# Altium project lab6.PrjPcb
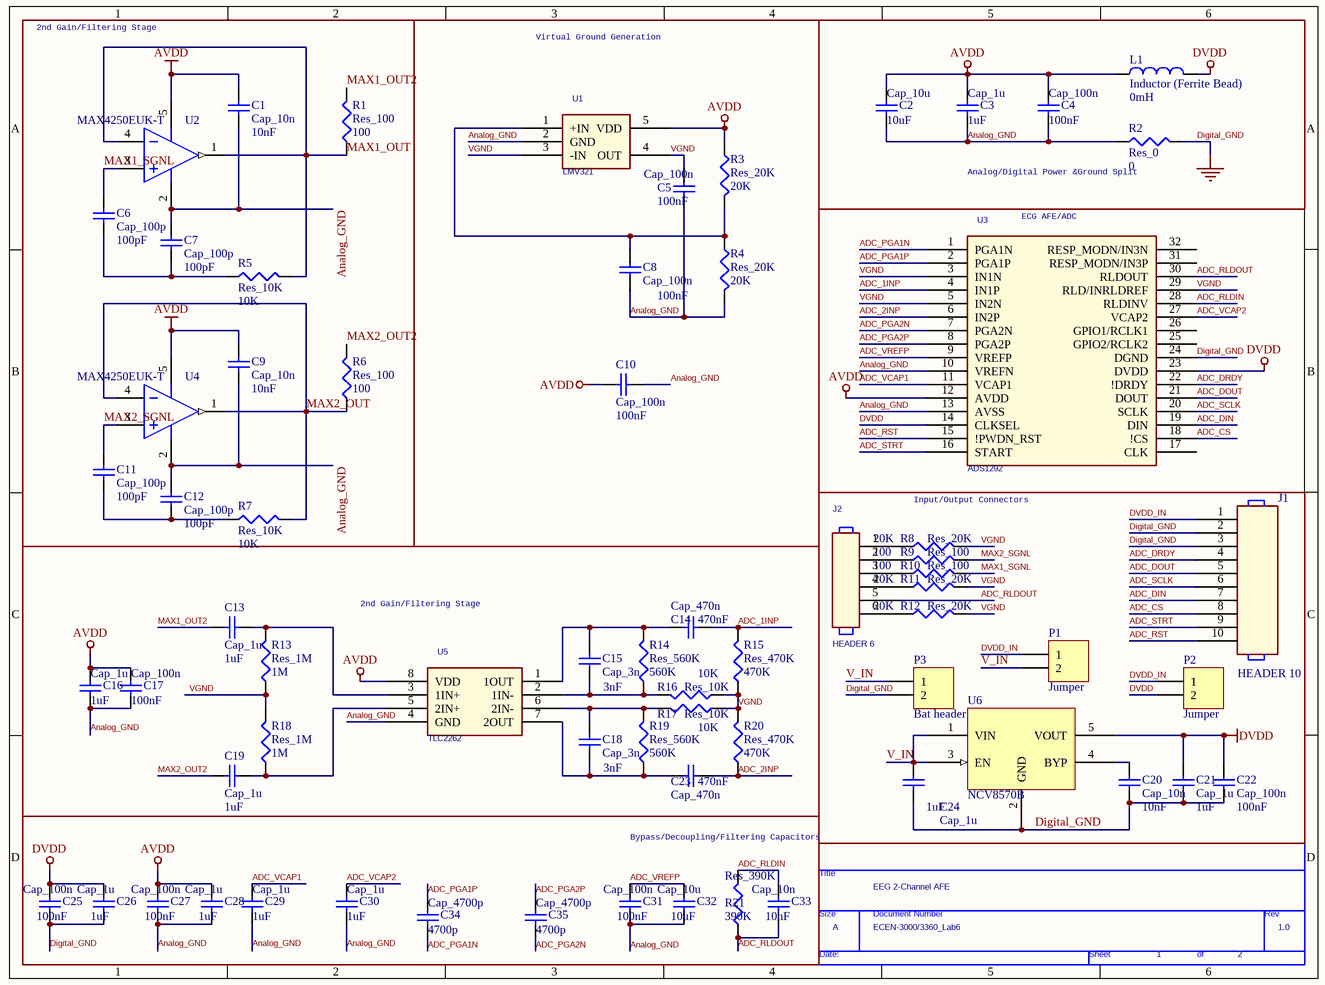
[diagram p0: Lab6.SchDoc]
1 sheet, 69 parts. Net scope: global (net labels, ports and power ports of the same name join across sheets).
Board file: Lab6.PcbDoc

## Sheet Lab6.SchDoc
size 246 x 182 mm

### Parts
*  Page Count: 2  Page Number: 1  Page Size: A  Title: EEG 2-Channel AFE  RevCode: 1.0  Doc: ECEN-3000/3360_Lab6  (hidden comment: TitleBlock0)  (graphical)
C1  Cap_10n  value 10nF  [SMD_0805]
C2  Cap_10u  value 10uF  [SMD_0805]
C3  Cap_1u  value 1uF  [SMD_0805]
C4  Cap_100n  value 100nF  [SMD_0805]
C5  Cap_100n  value 100nF  [SMD_0805]
C6  Cap_100p  value 100pF  [SMD_0805]
C7  Cap_100p  value 100pF  [SMD_0805]
C8  Cap_100n  value 100nF  [SMD_0805]
C9  Cap_10n  value 10nF  [SMD_0805]
C10  Cap_100n  value 100nF  [SMD_0805]
C11  Cap_100p  value 100pF  [SMD_0805]
C12  Cap_100p  value 100pF  [SMD_0805]
C13  Cap_1u  value 1uF  [SMD_0805]
C14  Cap_470n  value 470nF  [SMD_0805]
C15  Cap_3n  value 3nF  [SMD_0805]
C16  Cap_1u  value 1uF  [SMD_0805]
C17  Cap_100n  value 100nF  [SMD_0805]
C18  Cap_3n  value 3nF  [SMD_0805]
C19  Cap_1u  value 1uF  [SMD_0805]
C20  Cap_10n  value 10nF  [SMD_0805]
C21  Cap_1u  value 1uF  [SMD_0805]
C22  Cap_100n  value 100nF  [SMD_0805]
C23  Cap_470n  value 470nF  [SMD_0805]
C24  Cap_1u  value 1uF  [SMD_0805]
C25  Cap_100n  value 100nF  [SMD_0805]
C26  Cap_1u  value 1uF  [SMD_0805]
C27  Cap_100n  value 100nF  [SMD_0805]
C28  Cap_1u  value 1uF  [SMD_0805]
C29  Cap_1u  value 1uF  [SMD_0805]
C30  Cap_1u  value 1uF  [SMD_0805]
C31  Cap_100n  value 100nF  [SMD_0805]
C32  Cap_10u  value 10uF  [SMD_0805]
C33  Cap_10n  value 10nF  [SMD_0805]
C34  Cap_4700p  value 4700p  [SMD_0805]
C35  Cap_4700p  value 4700p  [SMD_0805]
J1  HEADER 10  [HDR1X10]
J2  HEADER 6  [HDR1X6]
L1  Inductor (Ferrite Bead)  value 0mH  [SMD_0805]
P1  Jumper  [HDR1X2]
P2  Jumper  [HDR1X2]
P3  Bat header  [HDR1X2]
R1  Res_100  value 100  [SMD_0805]
R2  Res_0  value 0  [SMD_0805]
R3  Res_20K  value 20K  [SMD_0805]
R4  Res_20K  value 20K  [SMD_0805]
R5  Res_10K  value 10K  [SMD_0805]
R6  Res_100  value 100  [SMD_0805]
R7  Res_10K  value 10K  [SMD_0805]
R8  Res_20K  value 20K  [SMD_0805]
R9  Res_100  value 100  [SMD_0805]
R10  Res_100  value 100  [SMD_0805]
R11  Res_20K  value 20K  [SMD_0805]
R12  Res_20K  value 20K  [SMD_0805]
R13  Res_1M  value 1M  [SMD_0805]
R14  Res_560K  value 560K  [SMD_0805]
R15  Res_470K  value 470K  [SMD_0805]
R16  Res_10K  value 10K  [SMD_0805]
R17  Res_10K  value 10K  [SMD_0805]
R18  Res_1M  value 1M  [SMD_0805]
R19  Res_560K  value 560K  [SMD_0805]
R20  Res_470K  value 470K  [SMD_0805]
R21  Res_390K  value 390K  [SMD_0805]
U1  LMV321  [MAA05A_M]
U2  MAX4250EUK-T  [SOT23-5_L]
U3  ADS1292  [ADS1292_PQFP32]
U4  MAX4250EUK-T  [SOT23-5_L]
U5  TLC2262  [TLC2262_SOIC8]
U6  NCV8570B  [TSOP-5_483-02]

### Blocks framed on the sheet
2nd Gain/Filtering Stage: C1 C6 C7 C9 C11 C12 R1 R5-R7 U2 U4
Virtual Ground Generation: C5 C8 C10 R3 R4 U1
Analog/Digital Power & / Ground Split: C2-C4 L1 R2
Input/Output Connectors: * C20-C22 C24 J1 J2 P1-P3 R8-R12 U6
2nd Gain/Filtering Stage: C13-C19 C23 R13-R20 U5
Bypass/Decoupling/Filtering Capacitors: C25-C35 R21

### Nets
AVDD: C1.2 C2.2 C3.2 C4.2 C9.2 C10.2 C16.2 C17.2 C27.2 C28.2 L1.1 R3.1 U1.5(VDD) U2.5(VDD) U3.12(AVDD) U4.5(VDD) U5.8(VDD)
Digital_GND: C20.1 C21.1 C22.1 C24.1 C25.1 C26.1 J1.2 J1.3 P3.2 R2.2 U3.24(DGND) U6.2(GND)  [also labelled GND]
DVDD: C21.2 C22.2 C25.2 C26.2 L1.2 P2.2 U3.14(CLKSEL) U3.23(DVDD) U6.5(VOUT)
ADC_1INP: C14.1 R15.2 U3.4(IN1P)
ADC_2INP: C23.1 R20.1 U3.6(IN2P)
ADC_CS: J1.8 U3.18(!CS)
ADC_DIN: J1.7 U3.19(DIN)
ADC_DOUT: J1.5 U3.21(DOUT)
ADC_DRDY: J1.4 U3.22(!DRDY)
ADC_PGA1N: C34.1 U3.1(PGA1N)
ADC_PGA1P: C34.2 U3.2(PGA1P)
ADC_PGA2N: C35.1 U3.7(PGA2N)
ADC_PGA2P: C35.2 U3.8(PGA2P)
ADC_RLDIN: C33.2 R21.2 U3.28(RLDINV)
ADC_RLDOUT: C33.1 J2.5 R21.1 U3.30(RLDOUT)
ADC_RST: J1.10 U3.15(!PWDN_RST)
ADC_SCLK: J1.6 U3.20(SCLK)
ADC_STRT: J1.9 U3.16(START)
ADC_VCAP1: C29.2 U3.11(VCAP1)
ADC_VCAP2: C30.2 U3.27(VCAP2)
ADC_VREFP: C31.2 C32.2 U3.9(VREFP)
Analog_GND: C1.1 C2.1 C3.1 C4.1 C5.1 C7.1 C8.1 C9.1 C10.1 C12.1 C16.1 C17.1 C27.1 C28.1 C29.1 C30.1 C31.1 C32.1 R2.1 R4.2 U1.2(GND) U2.2(VSS) U3.10(VREFN) U3.13(AVSS) U4.2(VSS) U5.4(GND)
DVDD_IN: J1.1 P1.1 P2.1
MAX1_OUT: R1.1 R5.2 U2.1(OUT) U2.4(IN-)
MAX1_OUT2: C13.2 R1.2
MAX1_SGNL: C6.1 R10.2 U2.3(IN+)
MAX2_OUT: R6.1 R7.2 U4.1(OUT) U4.4(IN-)
MAX2_OUT2: C19.2 R6.2
MAX2_SGNL: C11.1 R9.2 U4.3(IN+)
V_IN: C24.2 P1.2 P3.1 U6.1(VIN) U6.3(EN)
VGND: C5.2 R8.2 R11.2 R12.2 R13.1 R15.1 R16.1 R17.1 R18.2 R20.2 U1.3(-IN) U1.4(OUT) U3.3(IN1N) U3.5(IN2N) U3.29(RLD/INRLDREF)
NetC6_2: C6.2 C7.2 R5.1
NetC8_2: C8.2 R3.2 R4.1 U1.1(+IN)
NetC11_2: C11.2 C12.2 R7.1
NetC13_1: C13.1 R13.2 U5.3(1IN+)
NetC14_2: C14.2 C15.2 R14.2 U5.1(1OUT)
NetC15_1: C15.1 R14.1 R16.2 U5.2(1IN-)
NetC18_1: C18.1 C23.2 R19.1 U5.7(2OUT)
NetC18_2: C18.2 R17.2 R19.2 U5.6(2IN-)
NetC19_1: C19.1 R18.1 U5.5(2IN+)
NetC20_2: C20.2 U6.4(BYP)
NetJ2_1: J2.1 R8.1
NetJ2_2: J2.2 R9.1
NetJ2_3: J2.3 R10.1
NetJ2_4: J2.4 R11.1
NetJ2_6: J2.6 R12.1

Not connected (* = marked no-connect by the designer): U3 17(CLK) 25(GPIO2/RCLK2) 26(GPIO1/RCLK1) 31(RESP_MODN/IN3P) 32(RESP_MODN/IN3N)

### Notes on the sheet
- (near U3) ECG AFE/ADC
- (in symbol TitleBlock0) Title; Size; Document Number; Rev; Date:; Sheet; of

### Library data of the parts
C1-C35 = Cap Semi: Capacitor (Semiconductor SIM Model); Published: 8-Jun-2000; LatestRevisionDate: 29-May-2009; LatestRevisionNote: IPC-7351 Footprint Added.; PackageReference: C1206; Publisher: Altium Limited; PackageDescription: Chip Capacitor
L1 = Inductor: Code_IEC: 1005; Published: 8-Jun-2000; LatestRevisionDate: 29-May-2009; LatestRevisionNote: IPC-7351 Footprint Added.; PackageReference: 0402-A; Publisher: Altium Limited; PackageDescription: Chip Inductor; Code_JEITA: 0402
P1-P3 = Header 2: Header, 2-Pin; LatestRevisionDate: 17-Jul-2002; LatestRevisionNote: Re-released for DXP Platform.; Publisher: Altium Limited
R1 R6 = Res3: R_subject_decouple; Published: 8-Jun-2000; LatestRevisionDate: 29-May-2009; LatestRevisionNote: IPC-7351 Footprint Added.; PackageReference: J1-0603; Publisher: Altium Limited; PackageDescription: Chip Resistor
R2-R5 R7-R21 = Res3: Resistor; Published: 8-Jun-2000; LatestRevisionDate: 29-May-2009; LatestRevisionNote: IPC-7351 Footprint Added.; PackageReference: J1-0603; Publisher: Altium Limited; PackageDescription: Chip Resistor
U2 U4 = MAX4250EUK-T: SOT23, Single-Supply, Low-Noise, Low-Distortion, Rail-to-Rail Op Amp; Published: 23-Sep-2002; LatestRevisionDate: 29-May-2009; LatestRevisionNote: IPC-7351 Footprint Added.; DatasheetVersion: Rev 2; 4/98; PackageVersion: revE, 2004; PackageReference: SOT23-5; Publisher: Altium Limited; PackageDescription: 5-Pin SOT-23 Package 0.95 mm Pitch, 2.8 mm Lead Span; Code_JEITA: SC-74A; Code_IPC: SOT23-5; ComponentLink1Description: Manufacturer Link; ComponentLink1URL: http://www.maxim-ic.com/; ComponentLink2Description: Datasheet; ComponentLink2URL: http://pdfserv.maxim-ic.com/en/ds/MAX4249-MAX4257.pdf
* = TitleBlock0: Page Create Date: March  8, 1995